# Altium schematic sheet pll-filters.SchDoc
size A
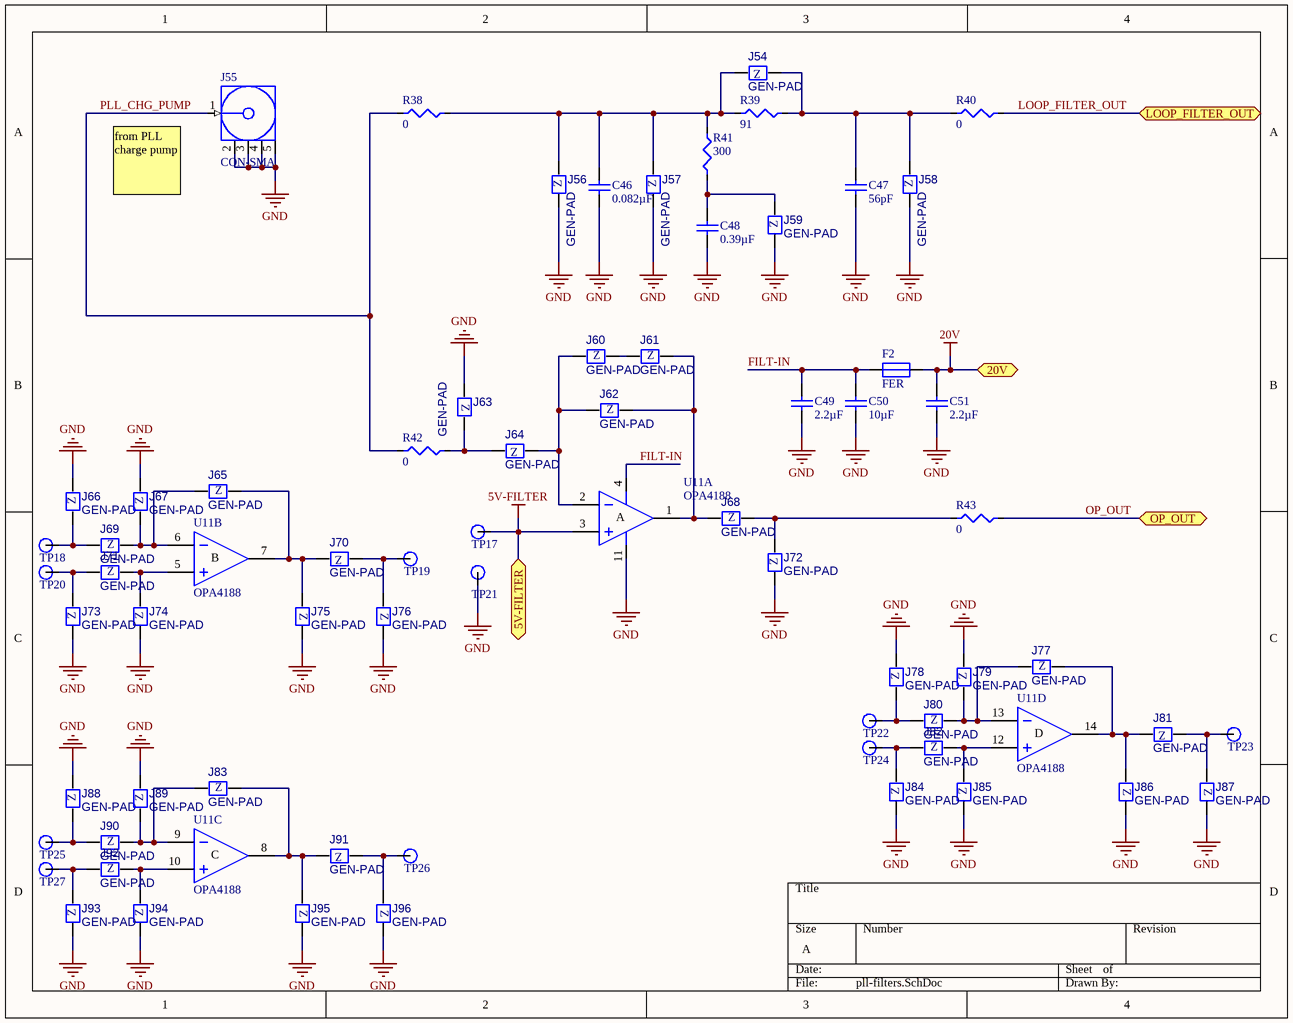
[diagram p0: pll-filters.SchDoc]

## Parts
C46  0.082µF  [C0603-0.8MM]
C47  56pF  [0402-0.55mm]
C48  0.39µF  [0805-1.35MM]
C49  2.2µF  [0402-0.55mm]
C50  10µF  [C0805-1.25MM]
C51  2.2µF  [0402-0.55mm]
F2  FER  [0603-0.8mm]
J54  GEN-PAD  [0402-DNP]
J55  CON-SMA  [CON-COAX]
J56  GEN-PAD  [0805-DNP]
J57  GEN-PAD  [0402-DNP]
J58  GEN-PAD  [0805-DNP]
J59  GEN-PAD  [0402-DNP]
J60  GEN-PAD  [0805-DNP]
J61  GEN-PAD  [0805-DNP]
J62  GEN-PAD  [0805-DNP]
J63  GEN-PAD  [0805-DNP]
J64  GEN-PAD  [0805-DNP]
J65  GEN-PAD  [0805-DNP]
J66  GEN-PAD  [0805-DNP]
J67  GEN-PAD  [0805-DNP]
J68  GEN-PAD  [0805-DNP]
J69  GEN-PAD  [0805-DNP]
J70  GEN-PAD  [0805-DNP]
J71  GEN-PAD  [0805-DNP]
J72  GEN-PAD  [0805-DNP]
J73  GEN-PAD  [0805-DNP]
J74  GEN-PAD  [0805-DNP]
J75  GEN-PAD  [0805-DNP]
J76  GEN-PAD  [0805-DNP]
J77  GEN-PAD  [0805-DNP]
J78  GEN-PAD  [0805-DNP]
J79  GEN-PAD  [0805-DNP]
J80  GEN-PAD  [0805-DNP]
J81  GEN-PAD  [0805-DNP]
J82  GEN-PAD  [0805-DNP]
J83  GEN-PAD  [0805-DNP]
J84  GEN-PAD  [0805-DNP]
J85  GEN-PAD  [0805-DNP]
J86  GEN-PAD  [0805-DNP]
J87  GEN-PAD  [0805-DNP]
J88  GEN-PAD  [0805-DNP]
J89  GEN-PAD  [0805-DNP]
J90  GEN-PAD  [0805-DNP]
J91  GEN-PAD  [0805-DNP]
J92  GEN-PAD  [0805-DNP]
J93  GEN-PAD  [0805-DNP]
J94  GEN-PAD  [0805-DNP]
J95  GEN-PAD  [0805-DNP]
J96  GEN-PAD  [0805-DNP]
R38  0  [0805-0.45MM]
R39  91  [0805-0.45MM]
R40  0  [0805-0.45MM]
R41  300  [0805-0.45MM]
R42  0  [0805-0.45MM]
R43  0  [0805-0.45MM]
TP17  TP-LOOP  [TP-LOOP]  (value not drawn)
TP18  TP-LOOP  [TP-LOOP]  (value not drawn)
TP19  TP-LOOP  [TP-LOOP]  (value not drawn)
TP20  TP-LOOP  [TP-LOOP]  (value not drawn)
TP21  TP-LOOP  [TP-LOOP]  (value not drawn)
TP22  TP-LOOP  [TP-LOOP]  (value not drawn)
TP23  TP-LOOP  [TP-LOOP]  (value not drawn)
TP24  TP-LOOP  [TP-LOOP]  (value not drawn)
TP25  TP-LOOP  [TP-LOOP]  (value not drawn)
TP26  TP-LOOP  [TP-LOOP]  (value not drawn)
TP27  TP-LOOP  [TP-LOOP]  (value not drawn)
U11  OPA4188  [TSSOP14]  (parts A,B,C,D of 4)

## Ports
5V-FILTER, 20V, LOOP_FILTER_OUT, OP_OUT

## Nets
5V-FILTER: TP17.0 U11.3(IN+) ; port 5V-FILTER
20V: C51.2 F2.1 ; port 20V
GND: C46.1 C47.1 C48.1 C49.1 C50.1 C51.1 J55.2(GND) J55.3(GND) J55.4(GND) J55.5(GND) J56.2 J57.2 J58.2 J59.2 J63.2 J66.1 J67.1 J72.2 J73.2 J74.2 J75.1 J76.1 J78.1 J79.1 J84.2 J85.2 J86.1 J87.1 J88.1 J89.1 J93.2 J94.2 J95.1 J96.1 TP21.0 U11.11(V-)
FILT-IN: C49.2 C50.2 F2.2 U11.4(V+)
LOOP_FILTER_OUT: R40.2 ; port LOOP_FILTER_OUT
OP_OUT: R43.2 ; port OP_OUT
PLL_CHG_PUMP: J55.1(Signal) R38.1 R42.1
NetC46_2: C46.2 J54.1 J56.1 J57.1 R38.2 R39.1 R41.2
NetC47_2: C47.2 J54.2 J58.1 R39.2 R40.1
NetC48_2: C48.2 J59.1 R41.1
NetJ60_1: J60.1 J61.2
NetJ60_2: J60.2 J62.2 J64.2 U11.2(IN-)
NetJ61_1: J61.1 J62.1 J68.2 U11.1(OUT)
NetJ63_1: J63.1 J64.1 R42.2
NetJ65_1: J65.1 J70.1 J75.2 U11.7(OUT)
NetJ65_2: J65.2 J67.2 J69.1 U11.6(IN-)
NetJ66_2: J66.2 J69.2 TP18.0
NetJ68_1: J68.1 J72.1 R43.1
NetJ70_2: J70.2 J76.2 TP19.0
NetJ71_1: J71.1 J74.1 U11.5(IN+)
NetJ71_2: J71.2 J73.1 TP20.0
NetJ77_1: J77.1 J81.1 J86.2 U11.14(OUT)
NetJ77_2: J77.2 J79.2 J80.1 U11.13(IN-)
NetJ78_2: J78.2 J80.2 TP22.0
NetJ81_2: J81.2 J87.2 TP23.0
NetJ82_1: J82.1 J85.1 U11.12(IN+)
NetJ82_2: J82.2 J84.1 TP24.0
NetJ83_1: J83.1 J91.1 J95.2 U11.8(OUT)
NetJ83_2: J83.2 J89.2 J90.1 U11.9(IN-)
NetJ88_2: J88.2 J90.2 TP25.0
NetJ91_2: J91.2 J96.2 TP26.0
NetJ92_1: J92.1 J94.1 U11.10(IN+)
NetJ92_2: J92.2 J93.1 TP27.0

## Notes on the sheet
- (near J55) from PLL charge pump
- (in symbol EE-GEN-00001) Z
- (in symbol EE-GEN-00002) Z
- (in symbol TSSOP14, part A) A
- (in symbol TSSOP14, part B) B
- (in symbol TSSOP14, part C) C
- (in symbol TSSOP14, part D) D

## Library data of the parts
C46 = EE-CAP-00005: Capacitor; Part Description: CAP CER 0.082UF 25V 10% X7R 0603; Manufacturer: Kemet; Manufacturer Part Number: C0603C823K3RACTU; Record Number: 5; Voltage: 25V; PackageDescription: Chip Capacitor; EE Part Number: EE-CAP-00005; Value: 0.082µF; Datasheet Link: C0603C823K3RACTU; Supplier 1: DigiKey; Supplier Part Number 1: 399-9128-1-ND; Supplier Link 1: DigiKey; Supplier 2: Mouser; Supplier Part Number 2: C0603C823K3RACTU; Supplier Link 2: Mouser
C47 = EE-CAP-00007: Capacitor; Part Description: CAP CER 56PF 50V 1% NP0 0402; Manufacturer: Murata; Manufacturer Part Number: GRM1555C1H560FA01D; Record Number: 7; Voltage: 50V; PackageDescription: Chip Capacitor; EE Part Number: EE-CAP-00007; Value: 56pF; Datasheet Link: GRM1555C1H560FA01D; Supplier 1: DigiKey; Supplier Part Number 1: 490-8211-1-ND; Supplier Link 1: DigiKey; Supplier 2: Mouser; Supplier Part Number 2: 81-GRM1555C1H560FA1D; Supplier Link 2: Mouser
C48 = EE-CAP-00006: Capacitor; Part Description: CAP CER 0.39UF 25V 10% X7R 0805; Manufacturer: Kemet; Manufacturer Part Number: C0805C394K3RACTU; Record Number: 6; Voltage: 25V; PackageDescription: Chip Capacitor; EE Part Number: EE-CAP-00006; Value: 0.39µF; Datasheet Link: C0805C394K3RACTU; Supplier 1: DigiKey; Supplier Part Number 1: 399-9238-1-ND; Supplier Link 1: DigiKey; Supplier 2: Mouser; Supplier Part Number 2: 80-C0805C394K3R; Supplier Link 2: Mouser
C49 C51 = EE-CAP-00003: Capacitor; Part Description: CAP CER 2.2UF 35V 10% X5R 0402; Manufacturer: TDK; Manufacturer Part Number: C1005X5R1V225K050BC; Record Number: 3; Voltage: 35V; PackageDescription: Chip Capacitor; EE Part Number: EE-CAP-00003; Value: 2.2µF; Datasheet Link: C1005X5R1V225K050BC; Supplier 1: DigiKey; Supplier Part Number 1: 445-9028-1-ND; Supplier Link 1: DigiKey; Supplier 2: Mouser; Supplier Part Number 2: 810-C1005X5R1V225K; Supplier Link 2: Mouser
C50 = EE-CAP-00002: Capacitor; Part Description: CAP CER 10UF 35V 10% JB 0805; Manufacturer: TDK; Manufacturer Part Number: C2012JB1V106K085AC; Record Number: 2; Voltage: 35V; PackageDescription: Chip Capacitor; EE Part Number: EE-CAP-00002; Value: 10µF; Datasheet Link: C2012JB1V106K085AC; Supplier 1: DigiKey; Supplier Part Number 1: 445-11516-1-ND; Supplier Link 1: DigiKey
F2 = EE-FER-00001: Part Description: FERRITE CHIP SIGNAL 2200 OHM SMD; Manufacturer: Laird-Signal; Manufacturer Part Number: HZ0603A222R-10; Record Number: 1; Value: 2.2k Ohms; Resistance (mOhms): 1500; Current (A): 100mA; Impedance @ 100MHz: 2200; EE Part Number: EE-FER-00001; Datasheet Link: HZ0603A222R-10; Supplier 1: DigiKey; Supplier Part Number 1: 240-2377-1-ND; Supplier Link 1: DigiKey; Supplier 2: Mouser; Supplier Part Number 2: 875-HZ0603A222R-10; Supplier Link 2: Mouser
J54 J57 J59 = EE-GEN-00002: Generic Component; Part Description: 0402 Generic Comp; Record Number: 2; EE Part Number: EE-GEN-00002; Value: GEN-0402; Pins: 2; Manufacturer: N/A; Manufacturer Part Number: N/A; Supplier 1: N/A; Supplier Part Number 1: N/A
J55 = EE-CON-00001: Part Description: SMA Jack, 1.73mm (.068) Board Clearance, End Launched, DC-26.5 GHz, Gold plated.; Manufacturer: East Coast Microwave; Manufacturer Part Number: PSF-S01-008; Record Number: 1; Value: SMA-1.73mm; EE Part Number: EE-CON-00001; Pins: 5; Datasheet Link: PSF-S01-008; Supplier 1: ECM; Supplier Part Number 1: PSF-S01-008; Supplier Link 1: ECM
J56 J58 J60-J96 = EE-GEN-00001: Generic Component; Part Description: 0805 Generic Comp; Record Number: 1; EE Part Number: EE-GEN-00001; Value: GEN-0805; Pins: 2; Manufacturer: N/A; Manufacturer Part Number: N/A; Supplier 1: N/A; Supplier Part Number 1: N/A
R38 R40 R42 R43 = EM-RES-01617: Part Description: RES 0.0 OHM .33W 0805 SMD; Manufacturer: Vishay; Manufacturer Part Number: CRCW08050000Z0EAHP; Record Number: 1617; Power: 0.33W; EM Part Number: EM-RES-01617; Value: 0; Tolerance: N/A; Datasheet Link: http://www.vishay.com/docs/20043/crcwhpe3.pdf; Supplier 1: Digi-Key; Supplier Part Number 1: 541-0.0TBCT-ND; Supplier Link 1: http://www.Digi-Key.com/product-detail/en/CRCW08050000Z0EAHP/541-0.0TBCT-ND/2222831
R39 = EM-RES-01374: Part Description: RES 91.0 OHM 1/8W 1% 0805 SMD; Manufacturer: Vishay; Manufacturer Part Number: CRCW080591R0FKEA; Record Number: 1374; Tolerance: 1%; Power: 0.125W; EM Part Number: EM-RES-01374; Value: 91; Supplier 1: Digi-Key; Supplier Part Number 1: 541-91.0CCT-ND
R41 = EM-RES-01318: Part Description: RES 300 OHM 1/8W 1% 0805 SMD; Manufacturer: Vishay; Manufacturer Part Number: CRCW0805300RFKEA; Record Number: 1318; Tolerance: 1%; Power: 0.125W; EM Part Number: EM-RES-01318; Value: 300; Supplier 1: Digi-Key; Supplier Part Number 1: 541-300CCT-ND
TP17-TP27 = EM-TP-00006: Part Description: 0.040" Test Point; Record Number: 6; EM Part Number: EM-TP-00006; Value: TP-LOOP; Pins: 1; Manufacturer: N/A; Manufacturer Part Number: N/A; Supplier 1: N/A; Supplier Part Number 1: N/A
U11 = TSSOP14: Quad Op-Aamp; EE Part Number: EE-OPAMP-00004; Part Description: IC OPAMP ZERO-DRIFT 2MHZ 14TSSOP; Manufacturer: TI; Record Number: 4; Frequency Range: 2MHz; Value: OPA4188AIPW; Voltage: 4 V ~ 36 V, ±2 V ~ 18 V; Drive Current: 415µA; Channels: 4; Package: 14-TSSOP; Manufacturer Part Number: OPA4188AIPW; Datasheet Link: OPA4188AIPW; Supplier 1: DigiKey; Supplier Part Number 1: 296-36432-5-ND; Supplier Link 1: DigiKey; Supplier 2: Mouser; Supplier Part Number 2: 595-OPA4188AIPW; Supplier Link 2: Mouser